# Altium schematic sheet 07_ux.SchDoc
size B
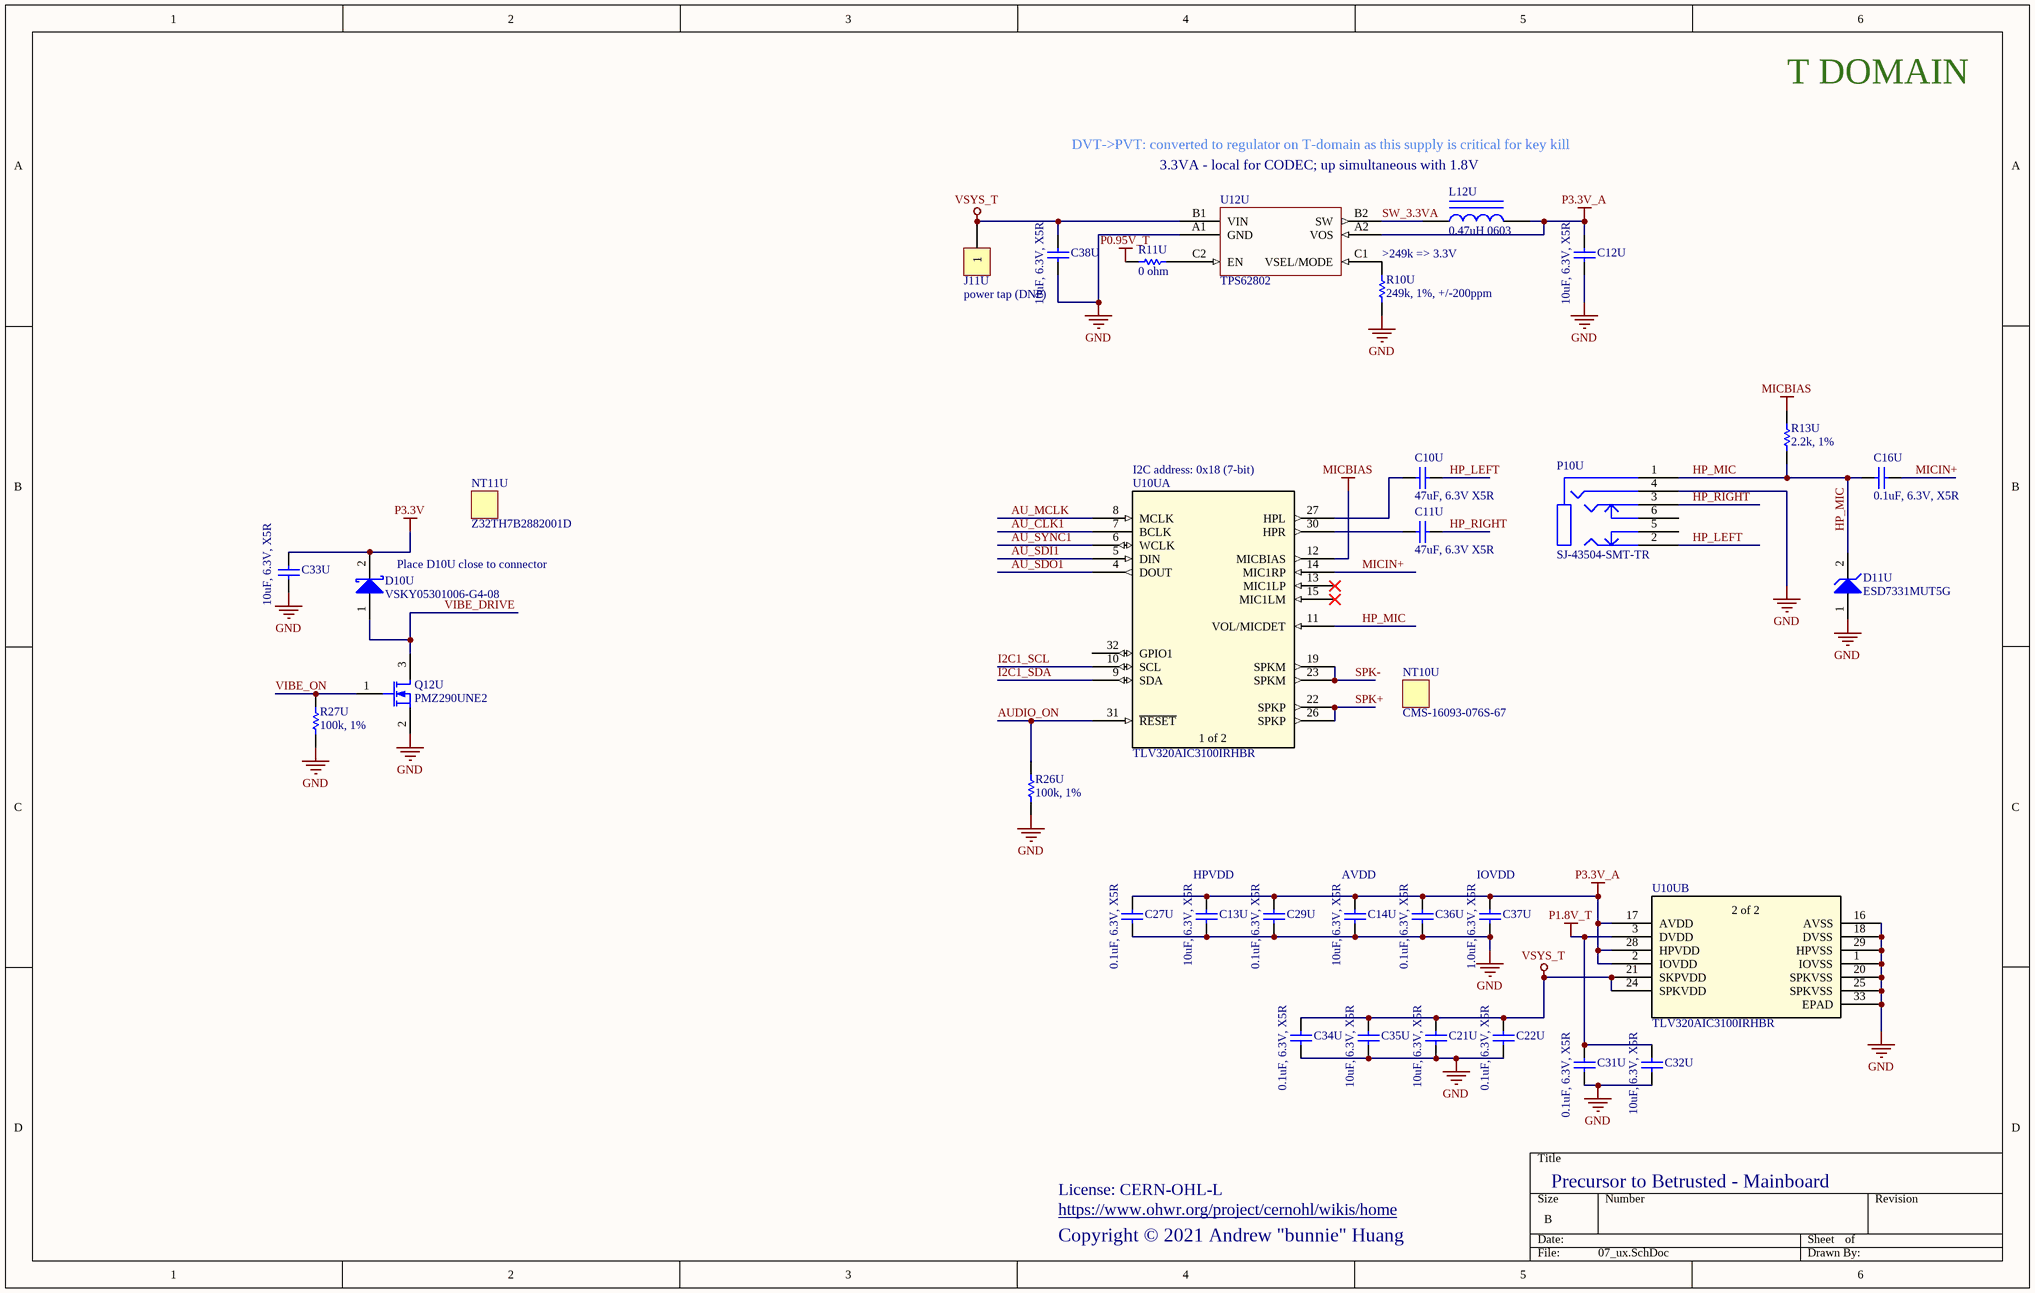
[diagram p0: 07_ux.SchDoc]

## Parts
C10U  47uF, 6.3V X5R  [B_CAP0805]
C11U  47uF, 6.3V X5R  [B_CAP0805]
C12U  10uF, 6.3V, X5R  [B_CAP0603]
C13U  10uF, 6.3V, X5R  [B_CAP0603]
C14U  10uF, 6.3V, X5R  [B_CAP0603]
C16U  0.1uF, 6.3V, X5R  [B_CAP0201]
C21U  10uF, 6.3V, X5R  [B_CAP0603]
C22U  0.1uF, 6.3V, X5R  [B_CAP0201]
C27U  0.1uF, 6.3V, X5R  [B_CAP0201]
C29U  0.1uF, 6.3V, X5R  [B_CAP0201]
C31U  0.1uF, 6.3V, X5R  [B_CAP0201]
C32U  10uF, 6.3V, X5R  [B_CAP0603]
C33U  10uF, 6.3V, X5R  [B_CAP0603]
C34U  0.1uF, 6.3V, X5R  [B_CAP0201]
C35U  10uF, 6.3V, X5R  [B_CAP0603]
C36U  0.1uF, 6.3V, X5R  [B_CAP0201]
C37U  1.0uF, 6.3V, X5R  [B_CAP0201]
C38U  10uF, 6.3V, X5R  [B_CAP0603]
D10U  VSKY05301006-G4-08  [B_DIO0402]
D11U  ESD7331MUT5G  [D_X3DFN2_0201]
J11U  power tap (DNP)  [B_PWRTAP0402]
L12U  0.47uH 0603  [B_IND0603]
NT10U  CMS-16093-076S-67
NT11U  Z32TH7B2882001D
P10U  SJ-43504-SMT-TR  [CUI_SJ_43504_SMT_TR_FLIP]
Q12U  PMZ290UNE2  [SOT883]
R10U  249k, 1%, +/-200ppm  [B_RES0402]
R11U  0 ohm  [B_RES0201]
R13U  2.2k, 1%  [B_RES0201]
R26U  100k, 1%  [B_RES0201]
R27U  100k, 1%  [B_RES0201]
U10U  TLV320AIC3100IRHBR  [TI_VQFN_RHB0032E]  (parts A,B of 2)
U12U  TPS62802  [BGA6C35P2X3_70X105X40_NSMD]

## Nets
GND: C12U.2 C13U.2 C14U.2 C21U.2 C22U.2 C27U.2 C29U.2 C31U.2 C32U.2 C33U.1 C34U.2 C35U.2 C36U.2 C37U.1 C38U.2 D11U.1(A) P10U.4(RING2) Q12U.2(S) R10U.2 R26U.1 R27U.1 U10U.1(IOVSS) U10U.16(AVSS) U10U.18(DVSS) U10U.20(SPKVSS) U10U.25(SPKVSS) U10U.29(HPVSS) U10U.33(EPAD) U12U.A1(GND)
MICBIAS: R13U.2 U10U.12(MICBIAS)
P0.95V_T: R11U.1
P1.8V_T: C31U.1 C32U.1 U10U.3(DVDD)
P3.3V: C33U.2 D10U.2(K)
P3.3V_A: C12U.1 C13U.1 C14U.1 C27U.1 C29U.1 C36U.1 C37U.2 L12U.2 U10U.2(IOVDD) U10U.17(AVDD) U10U.28(HPVDD) U12U.A2(VOS)
VSYS_T: C21U.1 C22U.1 C34U.1 C35U.1 C38U.1 J11U.1 U10U.21(SKPVDD) U10U.24(SPKVDD) U12U.B1(VIN)
AU_CLK1: U10U.7(BCLK)
AU_MCLK: U10U.8(MCLK)
AU_SDI1: U10U.5(DIN)
AU_SDO1: U10U.4(DOUT)
AU_SYNC1: U10U.6(WCLK)
AUDIO_ON: R26U.2 U10U.31(~{RESET})
HP_LEFT: C10U.2 P10U.2(TIP)
HP_MIC: C16U.1 D11U.2(K) P10U.1(SLEEVE) R13U.1 U10U.11(VOL/MICDET)
HP_RIGHT: C11U.2 P10U.3(RING1)
I2C1_SCL: U10U.10(SCL)
I2C1_SDA: U10U.9(SDA)
MICIN+: C16U.2 U10U.14(MIC1RP)
SPK+: U10U.22(SPKP) U10U.26(SPKP)
SPK-: U10U.19(SPKM) U10U.23(SPKM)
SW_3.3VA: L12U.1 U12U.B2(SW)
VIBE_DRIVE: D10U.1(A) Q12U.3(D)
VIBE_ON: Q12U.1(G) R27U.2
NetC10U_1: C10U.1 U10U.27(HPL)
NetC11U_1: C11U.1 U10U.30(HPR)
NetR10U_1: R10U.1 U12U.C1(VSEL/MODE)
NetR11U_2: R11U.2 U12U.C2(EN)

Not connected (* = marked no-connect by the designer): P10U 5(TIP_SW) 6(RING1_SW); U10U 13(MIC1LP)* 15(MIC1LM)* 32(GPIO1)

## Notes on the sheet
- T DOMAIN
- DVT->PVT: converted to regulator on T-domain as this supply is critical for key kill
- 3.3VA - local for CODEC; up simultaneous with 1.8V
- (near R10U) >249k => 3.3V
- (near U10U) I2C address: 0x18 (7-bit)
- Place D10U close to connector
- (near C13U) HPVDD
- (near C14U) AVDD
- (near C37U) IOVDD
- License: CERN-OHL-L
- Copyright © 2021 Andrew "bunnie" Huang
- https://www.ohwr.org/project/cernohl/wikis/home
- Precursor to Betrusted - Mainboard
- (in symbol TLV320AIC3100IRH, part A) 1 of 2
- (in symbol TLV320AIC3100IRH, part B) 2 of 2

## Library data of the parts
C10U C11U = Cap Semi: Capacitor (Semiconductor SIM Model); MPN: CL21A476MQYNNNE; VENDOR: Samsung; MYPN: C-476-6.3-X5R-0805
C12U C13U C14U C21U C32U C33U C35U C38U = Cap Semi: Capacitor (Semiconductor SIM Model); MPN: CL10A106MQ8NNNC; VENDOR: Samsung; MYPN: C-106-6.3-X5R-0603
C16U C22U C27U C29U C31U C34U C36U = Cap Semi: Capacitor (Semiconductor SIM Model); MPN: CL03A104KQ3NNNC; VENDOR: Samsung; MYPN: C-104-6p3-X5R-0201
C37U = Cap Semi: Capacitor (Semiconductor SIM Model); MPN: GRM033R60J105MEA2D; VENDOR: Murata; MYPN: C-105-6p3-X5R-0201
D10U = Diode 11DQ03: Schottky Rectifier; MYPN: D-SCHOTTKY-0402-CSP; VENDOR: Vishay; ComponentLink1Description: Manufacturer Link; ComponentLink1URL: http://www.irf.com/; ComponentLink2Description: Datasheet; ComponentLink2URL: http://www.irf.com/product-info/datasheets/data/11dq03.pdf; MPN: VSKY05301006-G4-08
D11U = D Zener: VENDOR: ON Semi; MYPN: D-ESD7331MUT5G; Published: 8-Jun-2000; LatestRevisionDate: 17-Jul-2002; LatestRevisionNote: Re-released for DXP Platform.; PackageReference: DIODE-0.7; Publisher: Altium Limited; PackageDescription: Diode, Thru-Hole; 2 Leads; 0.7 in Pin Spacing; MPN: ESD7331MUT5G
J11U = CON1: Connector; MYPN: J-TP-PWRTAP-0603; MPN: DNP; VENDOR: DNP
L12U = Inductor Iron: Magnetic-Core Inductor; MPN: TFM160808ALC-R47MTAA; VENDOR: TDK; MYPN: L-TFM160808ALC-R47MTAA
NT10U = NOTE: Placeholder for non-board BOM items; MYPN: NT-CUI-SPEAKER; VENDOR: CUI or Soberton; MPN: CMS-16093-076S-67
NT11U = NOTE: Placeholder for non-board BOM items; MYPN: NT-JL-VIBEMOTOR-3.8MM-3.8MM; VENDOR: Jinlong; MPN: Z32TH7B2882001D
P10U = CUI_3.5MM_STEREO_MIC: Mid mount audio jack; VENDOR: CUI; MYPN: J-3.5MM-MID-CUI; MPN: SJ-43504-SMT-TR
Q12U = MOSFET-N: N-Channel MOSFET; VENDOR: Nexperia; MYPN: Q-PMZ290UNE2; Published: 8-Jun-2000; LatestRevisionDate: 17-Jul-2002; LatestRevisionNote: Re-released for DXP Platform.; PackageVersion: 1995/1996; PackageReference: E3; Publisher: Altium Limited; MPN: PMZ290UNE2
R10U = Res1: Resistor; MPN: RC0402FR-07249KL; VENDOR: Yageo; MYPN: R-2493-1P-1_16W-0402
R11U = Res1: Resistor; VENDOR: ANY; MYPN: R-0R0-1P-1_16W-0201; MPN: ANY
R13U = Res1: Resistor; VENDOR: ANY; MYPN: R-222-1P-1_16W-0201; MPN: ANY
R26U R27U = Res1: Resistor; VENDOR: ANY; MYPN: R-104-1P-1_16W-0201; MPN: ANY
U10U = TLV320AIC3100IRH: Low-Power Audio Codec With Audio Processing and Mono Class-D Amplifier; Manufacturer: Texas Instruments; MPN: TLV320AIC3100IRHBT; INDUSTRY_STD_PKG_TYPE: QFN; PIN_COUNT: 32; PACKAGE_DESIGNATOR: RHB; MYPN: U-TLV320AIC3100IRHBT; Datasheet_URL: http://www.ti.com/lit/gpn/TLV320AIC3100; FAMILY_NAME: Audio CODEC; GENERIC_PART_NUMBER: TLV320AIC3100; VENDOR: Texas Instruments; Manufacturer_Part_Number: TLV320AIC3100IRHBR; Copyright: Copyright (C) 2018 Accelerated Designs. All rights reserved; RefDes: RefDes; Type: DEV
U12U = TPS62802: Buck regulator, 4MHz, 0.6A, 1.8V-3.3V, low Iq; MPN: TPS62802YKAR; VENDOR: TI; MYPN: U-TPS62802YKA(T/R)